# EAGLE design module (EAGLE 7.7.0)
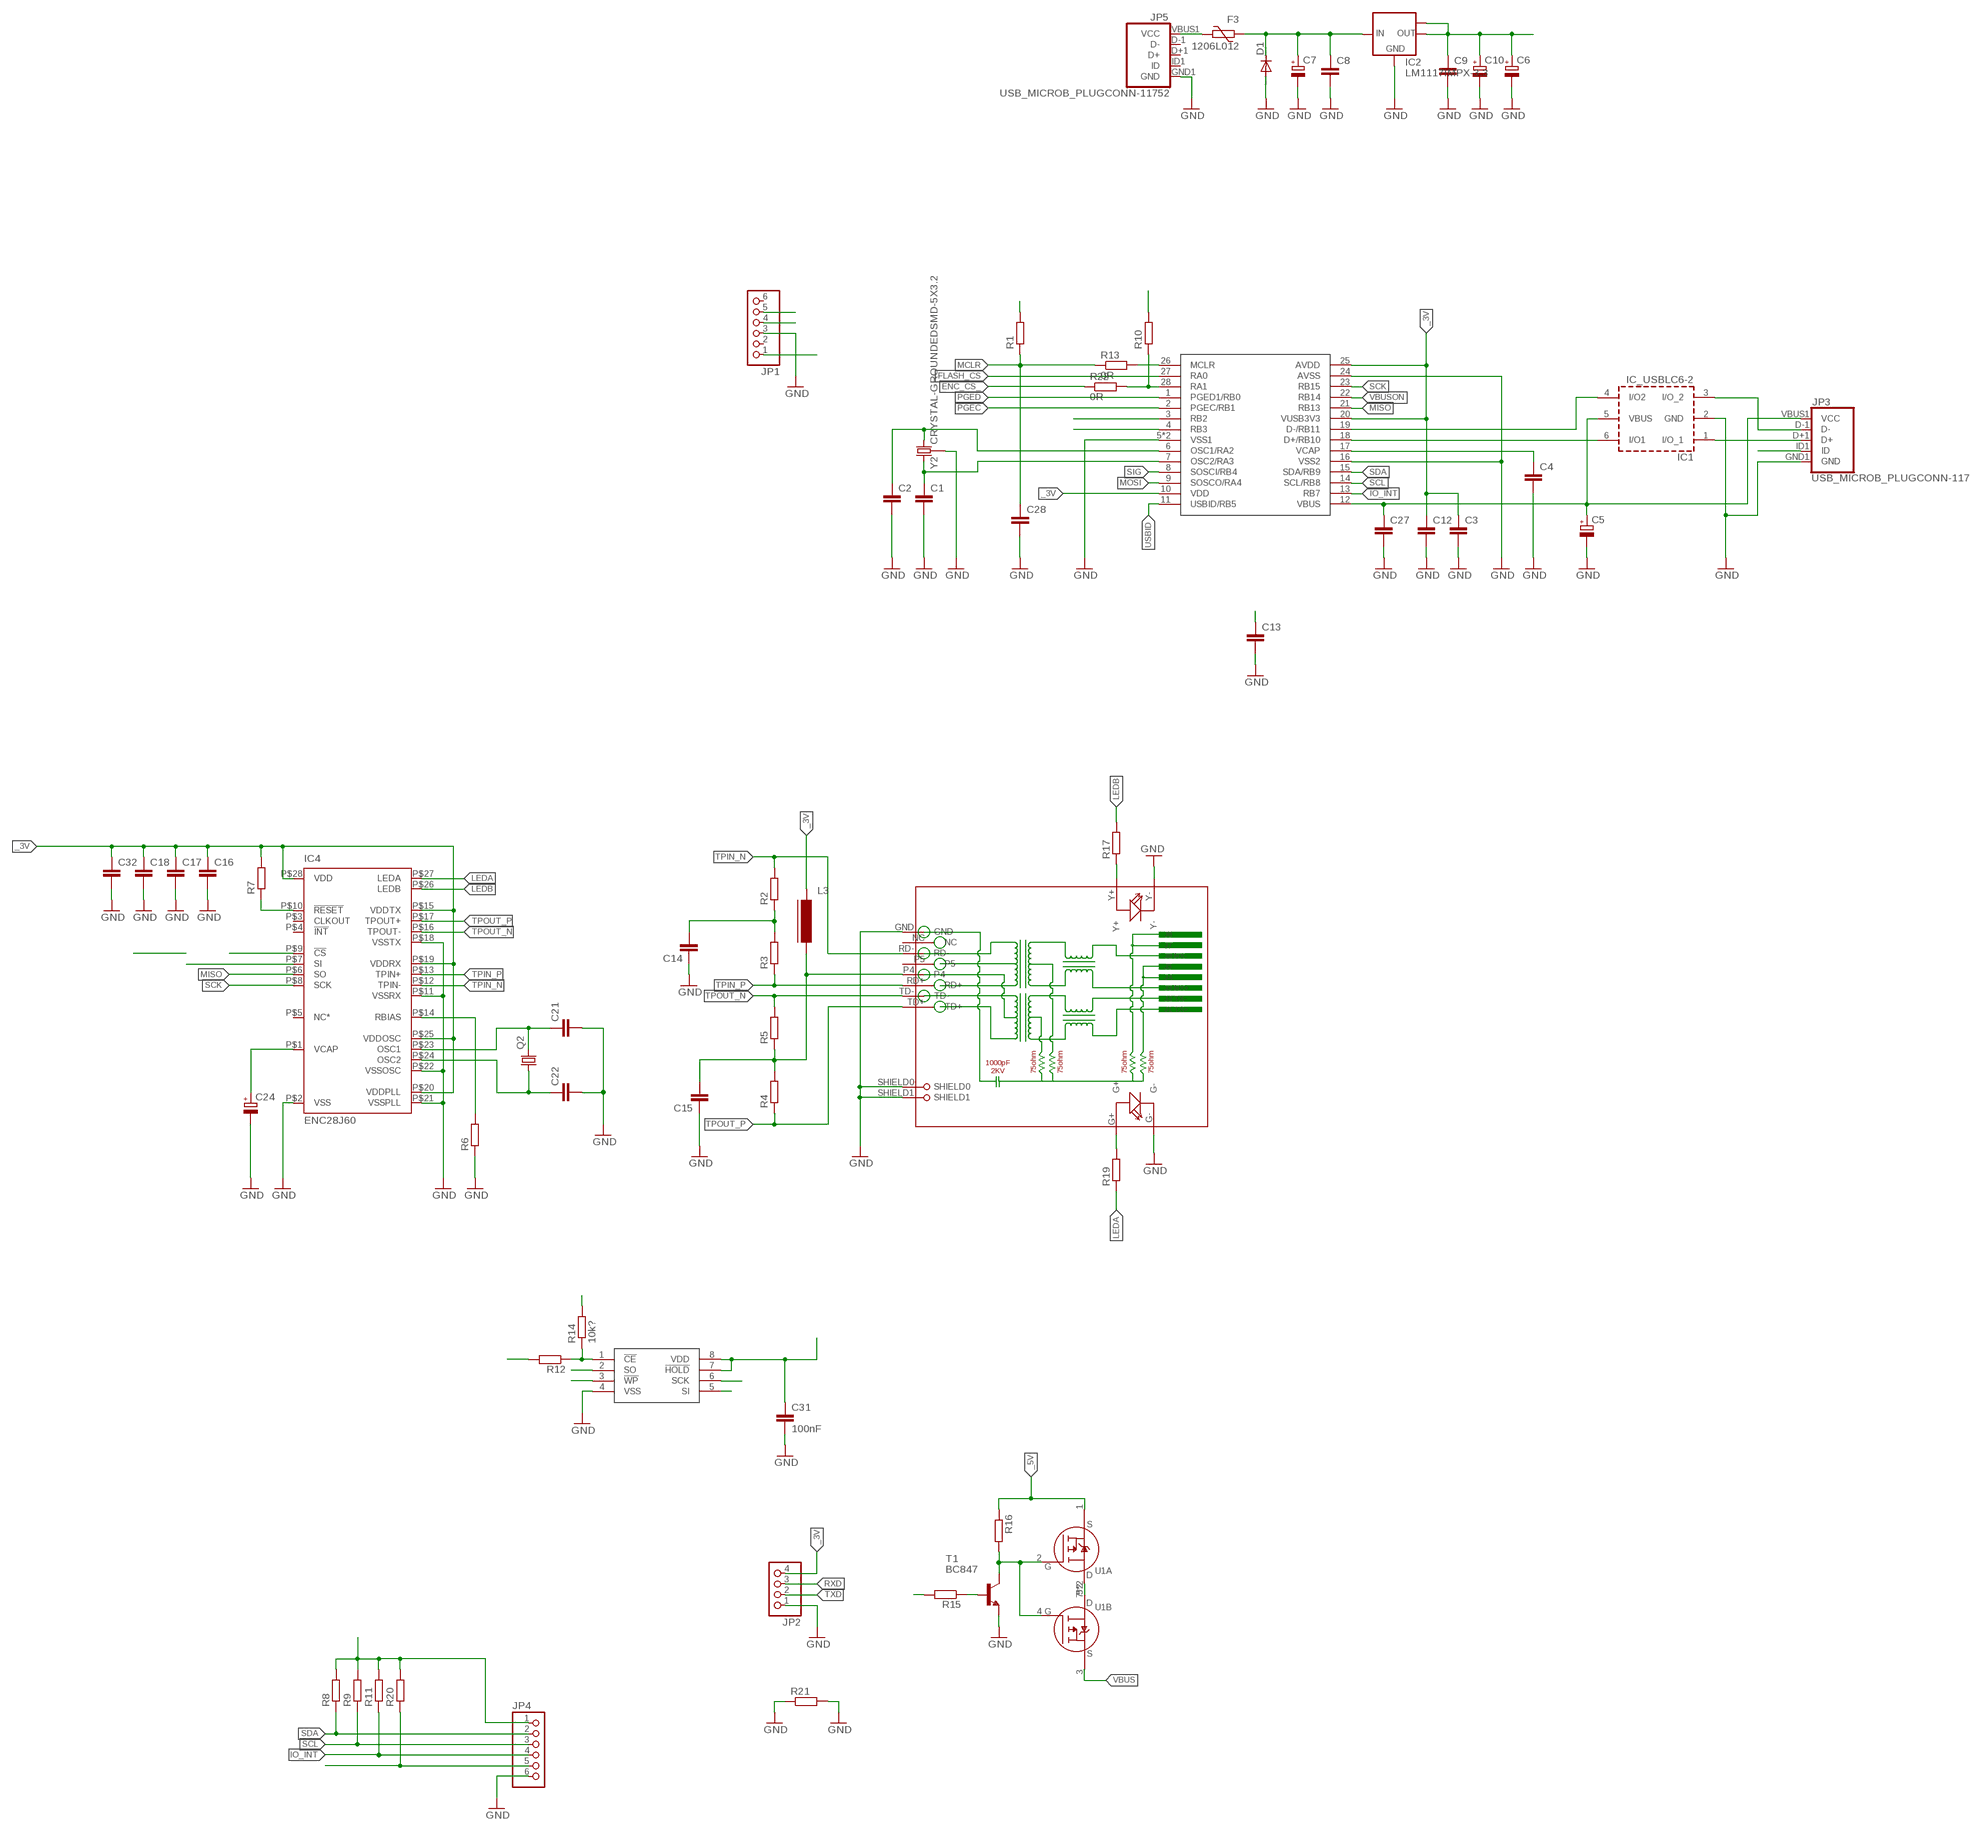
[diagram p0: schematic, sheet 1]

## Parts
C1  C-EUC0603  [C0603]
C2  C-EUC0603  [C0603]
C3  C-EUC0402  [C0402]
C4  C-EUC0603  [C0603]
C5  CPOL-EUSMCA  [SMC_A]
C6  CPOL-EUSMCA  [SMC_A]
C7  CPOL-EUSMCC  [SMC_C]
C8  C-EUC0603  [C0603]
C9  C-EUC0603  [C0603]
C10  CPOL-EUSMCB  [SMC_B]
C12  C-EUC0603  [C0603]
C13  C-EUC0603  [C0603]
C14  C-EUC0603  [C0603]
C15  C-EUC0603  [C0603]
C16  C-EUC0402  [C0402]
C17  C-EUC0402  [C0402]
C18  C-EUC0402  [C0402]
C21  C-EUC0603  [C0603]
C22  C-EUC0603  [C0603]
C24  CPOL-EUSMCA  [SMC_A]
C27  C-EUC0603  [C0603]
C28  C-EUC0603  [C0603]
C31  100nF  C-EUC0603  [C0603]
C32  C-EUC0402  [C0402]
D1  DIODE-SMB  [SMB]
F3  1206L012  [1206L]
IC1  IC_USBLC6-2  [SOT-23-6L]
IC2  LM1117IMPX-3.3  [SOT223]
IC4  ENC28J60  [TSSOP28W]
JP1  PINHD-1X6  [1X06]
JP2  PINHD-1X4  [1X04]
JP3  USB_MICROB_PLUGCONN-11752  [USB-B-MICRO-SMD_V03]
JP4  PINHD-1X6  [1X06]
JP5  USB_MICROB_PLUGCONN-11752  [USB-B-MICRO-SMD_V03]
L3  FERRITE-0805  [FB805]
Q2  CRYSTALHC49S  [HC49/S]
R1  R-EU_R0603  [R0603]
R2  R-EU_R0603  [R0603]
R3  R-EU_R0603  [R0603]
R4  R-EU_R0603  [R0603]
R5  R-EU_R0603  [R0603]
R6  R-EU_R0805  [R0805]
R7  R-EU_R0603  [R0603]
R8  R-EU_R0603  [R0603]
R9  R-EU_R0603  [R0603]
R10  R-EU_R0603  [R0603]
R11  R-EU_R0603  [R0603]
R12  R-EU_R0603  [R0603]
R13  0R  R-EU_R0603  [R0603]
R14  10k?  R-EU_R0603  [R0603]
R15  R-EU_R0603  [R0603]
R16  R-EU_R0402  [R0402]
R17  R-EU_R1206  [R1206]
R19  R-EU_R1206  [R1206]
R20  R-EU_R0603  [R0603]
R21  R-EU_R1206  [R1206]
R22  0R  R-EU_R0603  [R0603]
RJ1  HR911105A  [HR911105A]
T1  BC847  [SOT23]
U1  IRF7314_P_MOSFET  [SO-8]
U$1  PIC32MX250F128B  [QFN-S28-6X6]
U$2  SST25VF016BSO8M  [SO-08M]
Y2  CRYSTAL-GROUNDEDSMD-5X3.2  [CRYSTAL-SMD-5X3.2-4PAD]

## Nets
_3V: C3.1 C6.+ C9.1 C10.+ C12.1 C13.1 C16.1 C17.1 C18.1 C31.1 C32.1 IC2.2(OUT) IC2.TAB(OUT1) IC4.P$15(VDDTX) IC4.P$19(VDDRX) IC4.P$20(VDDPLL) IC4.P$25(VDDOSC) IC4.P$28(VDD) JP2.4 JP4.1 L3.1 R1.2 R7.2 R8.2 R9.2 R10.2 R11.2 R14.2 R20.2 U$1.10(VDD) U$1.20(VUSB3V3) U$1.25(AVDD) U$2.3(!WP) U$2.7(!HOLD) U$2.8(VDD)
_5V: C7.+ C8.1 D1.C F3.2 IC2.3(IN) R16.1 U1.1(A:S)
D_N: IC1.4(I/O2) U$1.19(D-/RB11)
D_P: IC1.6(I/O1) U$1.18(D+/RB10)
ENC_CS_: IC4.P$9(!CS) R22.1
ENC_RST: IC4.P$10(!RESET) R7.1
FLASH_CS: R12.2 U$1.27(RA0)
GND: C1.2 C2.2 C3.2 C4.2 C5.- C6.- C7.- C8.2 C9.2 C10.- C12.2 C13.2 C14.1 C15.1 C16.2 C17.2 C18.2 C21.2 C22.2 C24.- C27.2 C28.2 C31.2 C32.2 D1.A IC1.2(GND) IC2.1(GND) IC4.P$2(VSS) IC4.P$11(VSSRX) IC4.P$18(VSSTX) IC4.P$21(VSSPLL) IC4.P$22(VSSOSC) JP1.3 JP2.1 JP3.GND1(GND) JP4.6 JP5.GND1(GND) R6.1 R21.1 R21.2 RJ1.G- RJ1.GND RJ1.SHIELD0 RJ1.SHIELD1 RJ1.Y- T1.2(E) U$1.5(VSS1) U$1.16(VSS2) U$1.24(AVSS) U$1.EXP(VSS1) U$2.4(VSS) Y2.2 Y2.4
IO_INT: JP4.4 R11.1 U$1.13(RB7)
LEDA: IC4.P$27(LEDA) R19.1
LEDB: IC4.P$26(LEDB) R17.2
MCLR: C28.1 JP1.1 R1.1 R13.1
MCLR_: R13.2 U$1.26(MCLR)
MISO: IC4.P$6(SO) U$1.21(RB13) U$2.2(SO)
MOSI: IC4.P$7(SI) U$1.9(SOSCO/RA4) U$2.5(SI)
N$1: R15.1 T1.1(B)
N$2: C14.2 R2.1 R3.2
N$4: C1.1 U$1.7(OSC2/RA3) Y2.3
N$5: C2.1 U$1.6(OSC1/RA2) Y2.1
N$6: C15.2 L3.2 R4.2 R5.1 RJ1.P4
N$7: C4.1 U$1.17(VCAP)
N$8: F3.1 JP5.VBUS1(VCC)
N$9: IC1.1(I/O_1) JP3.D+1(D+)
N$10: IC1.3(I/O_2) JP3.D-1(D-)
N$11: R12.1 R14.1 U$2.1(!CE)
N$12: IC4.P$14(RBIAS) R6.2
N$13: R16.2 T1.3(C) U1.2(A:G) U1.4(B:G)
N$19: R10.1 R22.2 U$1.28(RA1)
N$20: U1.5(B:D) U1.6(B:D) U1.7(A:D) U1.8(A:D)
N$22: C21.1 IC4.P$23(OSC1) Q2.2
N$23: C22.1 IC4.P$24(OSC2) Q2.1
N$29: C24.+ IC4.P$1(VCAP)
N$30: R17.1 RJ1.Y+
N$31: R19.2 RJ1.G+
PGEC: JP1.5 U$1.2(PGEC/RB1)
PGED: JP1.4 U$1.1(PGED1/RB0)
RXD: JP2.3 U$1.3(RB2)
SCK: IC4.P$8(SCK) U$1.23(RB15) U$2.6(SCK)
SCL: JP4.3 R9.1 U$1.14(SCL/RB8)
SDA: JP4.2 R8.1 U$1.15(SDA/RB9)
SIG: JP4.5 R20.1 U$1.8(SOSCI/RB4)
TPIN_N: IC4.P$12(TPIN-) R2.2 RJ1.RD-
TPIN_P: IC4.P$13(TPIN+) R3.1 RJ1.RD+
TPOUT_N: IC4.P$16(TPOUT-) R5.2 RJ1.TD-
TPOUT_P: IC4.P$17(TPOUT+) R4.1 RJ1.TD+
TXD: JP2.2 U$1.4(RB3)
USBID: JP3.ID1(ID) U$1.11(USBID/RB5)
VBUS: C5.+ C27.1 IC1.5(VBUS) JP3.VBUS1(VCC) U1.3(B:S) U$1.12(VBUS)
VBUSON: R15.2 U$1.22(RB14)
Unconnected: IC4.P$3(CLKOUT) IC4.P$4(!INT) IC4.P$5(NC*) JP1.2 JP1.6 JP5.D+1(D+) JP5.D-1(D-) JP5.ID1(ID) RJ1.NC RJ1.P5

## Library data of the parts
C1-C4 C8 C9 C12-C18 C21 C22 C27 C28 C31 C32 = rcl:C-EU: CAPACITOR, European symbol
C5-C7 C10 C24 = rcl:CPOL-EU: POLARIZED CAPACITOR, European symbol
D1 = diode:DIODE-: DIODE
F3 = polyfuse-smd_10:?: Polyfuse Resettable PTC Source: http://www.littelfuse.com/products/resettable-ptcs.aspx; MF: Littelfuse; MPN: 1206L012; OC_FARNELL: 1596988; OC_NEWARK: 05M2298
IC1 = dp_devices:IC_USBLC6-2
IC2 = lm1117:LM1117IMPX-*
IC4 = microchip:ENC28J60: Stand-Alone Ethernet Controller with SPI Interface Source: http://ww1.microchip.com/downloads/en/DeviceDoc/39662c.pdf
JP1 JP4 = pinhead:PINHD-1X6: PIN HEADER
JP2 = pinhead:PINHD-1X4: PIN HEADER
JP3 JP5 = SparkFun-Connectors:USB_MICROB_PLUG: USB Micro-B connectors Some male, some female. Watch your step!; PROD_ID: CONN-11752
L3 = dp_devices:FERRITE: Ferrite bead in various packages
Q2 = crystal:CRYSTAL: CRYSTAL; OC_FARNELL: 1667008; OC_NEWARK: unknown
R1-R17 R19-R22 = rcl:R-EU_: RESISTOR, European symbol
RJ1 = hanrun:HR911105A
T1 = transistor:BC847: NPN TRANSISTOR
U1 = ihpcb-mosfet:IRF7314_P_MOSFET: P-channel MOSFET IRF7314 SO-8 package
U$1 = microchip-pic32mx_mod:PIC32MX250F128B
U$2 = mw:SST25VF016B
Y2 = SparkFun-Clocks:CRYSTAL-GROUNDED: Crystals w/ Ground Pin (Generic) These are passive quartz crystals, which can be used as a clock source for a microcontroller. Crystal's are usually two-terminal devices. A third terminal may be optionally connected to ground, as recommended by the manufaturer.

## Board
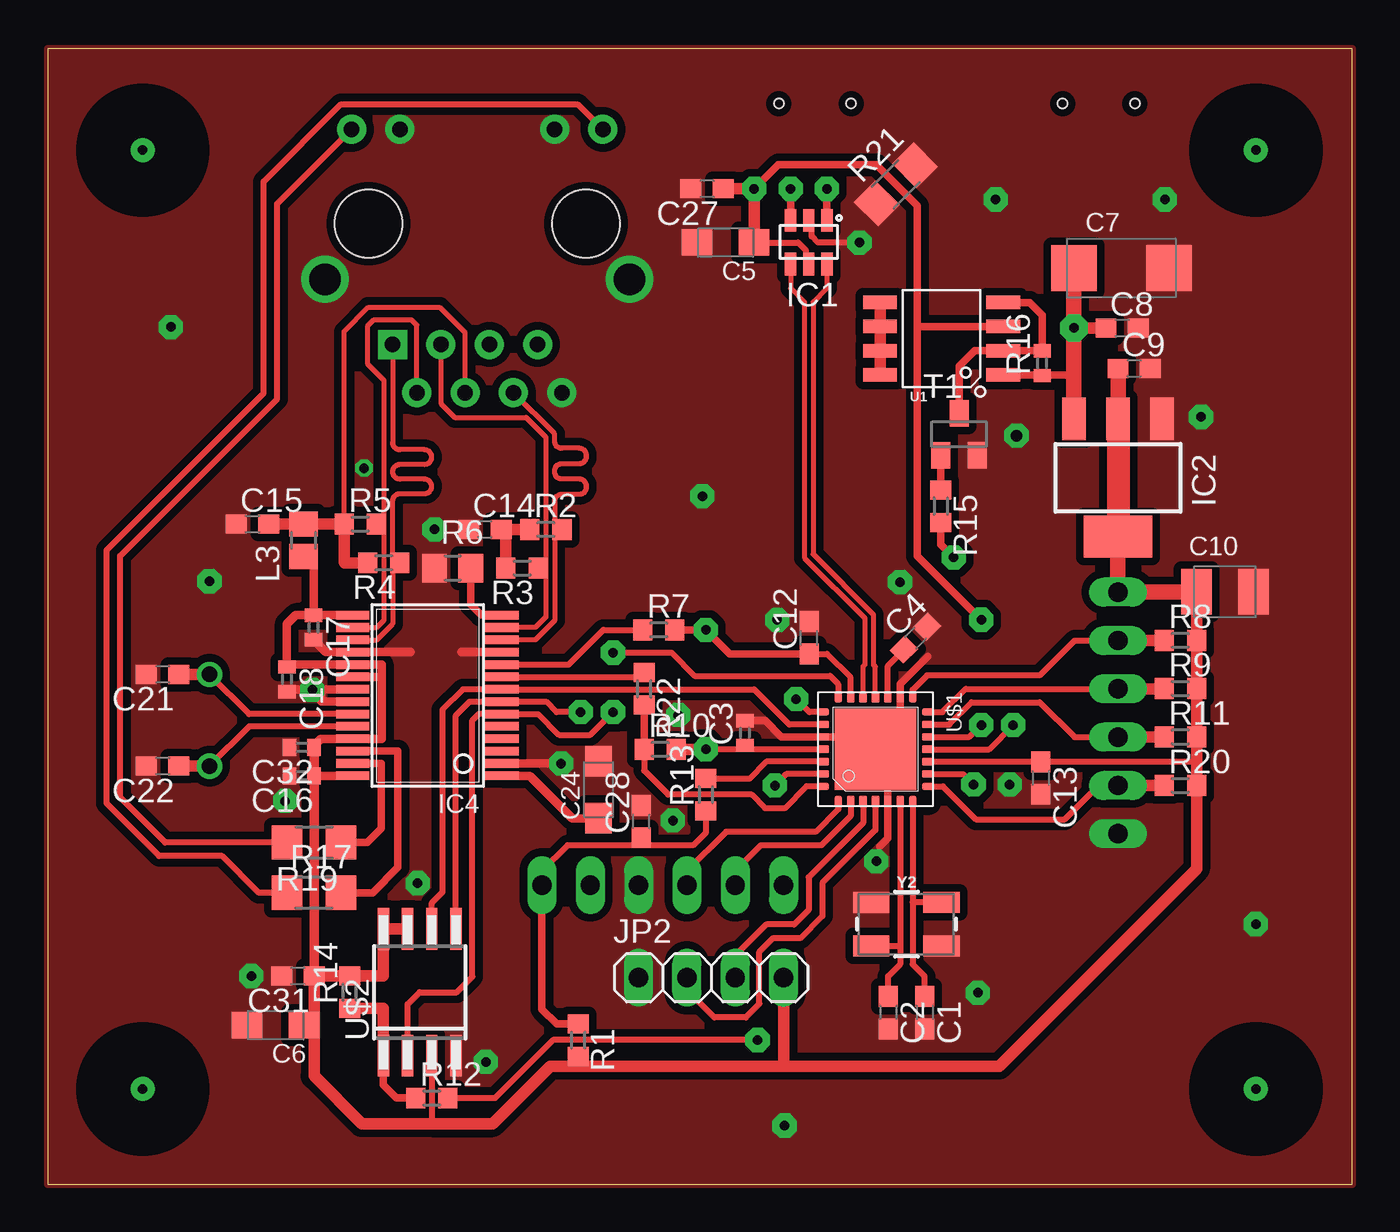
[diagram p1: board, top side]
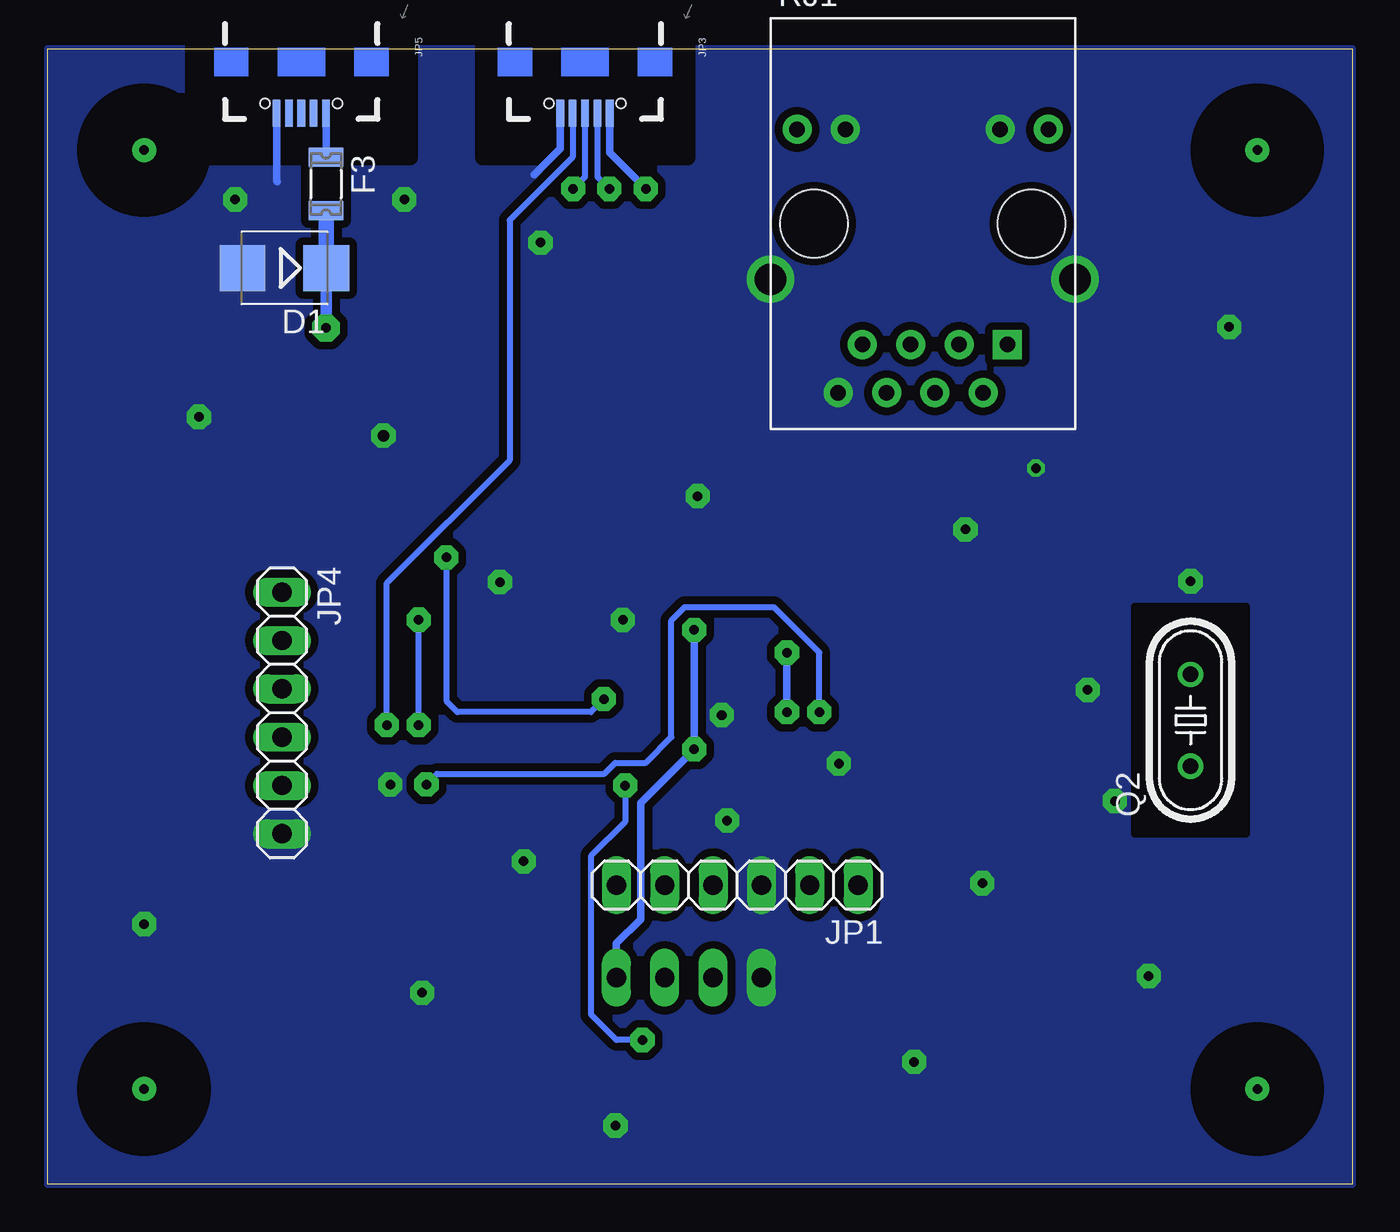
[diagram p2: board, bottom side, seen from below]

Size 68.58 x 59.69 mm. Coordinates in mm from the lower left corner, seen from the top.
Outline: 0,0 68.58,0 68.58,59.69 0,59.69 0,0
Copper layers (1*16): Top 0.035mm / dielectric 1.5mm / Bottom 0.035mm
Design rules "default *": minimum track width 10mil, minimum drill 24mil, track to track 8mil, track to pad 8mil, pad to pad 8mil, via to via 8mil, smd to smd 8mil, copper to edge 0mil, drill to drill 8mil, minimum pad ring 10mil, minimum via ring 8mil, stop-mask expansion 4mil, vias tented up to drill 0mil, thermal gap 10mil
tRestrict: area 39.7,50.2 to 40.3,51.2; area 15.1,21.2 to 16.9,30.1; area 23,21.2 to 24.8,30.1; area 40.7,20 to 46.4,25.7; area 2.2,51.6 to 7.8,57.2; area 60.7,51.6 to 66.3,57.2; area 2.2,2.2 to 7.8,7.8; area 60.7,2.2 to 66.3,7.8
bRestrict: area 34.9,54 to 45.7,59.7; area 49.5,54 to 61,59.7; area 2.2,51.6 to 7.8,57.2; area 60.7,51.6 to 66.3,57.2; area 2.2,2.2 to 7.8,7.8; area 60.7,2.2 to 66.3,7.8

### Footprints (pad centres in the part's own frame; a part is rotated, then mirrored left to right if it is on the bottom)
C0603 = smd 1.1 x 1: 1 -0.85,0; 2 0.85,0
C0402 = smd 0.7 x 0.9: 1 -0.65,0; 2 0.65,0
SMC_A = smd 1.6 x 1.4: + -1.5,0; - 1.5,0
SMC_C = smd 2.4 x 2.4: + -2.5,0; - 2.5,0
SMC_B = smd 1.6 x 2.4: + -1.5,0; - 1.5,0
SMB = smd 2.4 x 2.4: A 2.2,0; C -2.2,0
1206L = smd 1 x 1.8: 1 -1.4,0; 2 1.4,0
SOT-23-6L = smd 0.6 x 1.2: 1 -0.95,-2.3; 2 0,-2.3; 3 0.95,-2.3; 4 0.95,0; 5 0,0; 6 -0.95,0
SOT223 = smd 1.219 x 2.235: 1 -2.311,-3.099; 2 0,-3.099; 3 2.311,-3.099 | smd 3.6 x 2.2: TAB 0,3.099
TSSOP28W = smd 0.45 x 1.75: P$1 0,-0.65; P$2 0.65,-0.65; P$3 1.3,-0.65; P$4 1.95,-0.65; P$5 2.6,-0.65; P$6 3.25,-0.65; P$7 3.9,-0.65; P$8 4.55,-0.65; P$9 5.2,-0.65; P$10 5.85,-0.65; P$11 6.5,-0.65; P$12 7.15,-0.65; P$13 7.8,-0.65; P$14 8.45,-0.65; P$15 8.45,7.2; P$16 7.8,7.2; P$17 7.15,7.2; P$18 6.5,7.2; P$19 5.85,7.2; P$20 5.2,7.2; P$21 4.55,7.2; P$22 3.9,7.2; P$23 3.25,7.2; P$24 2.6,7.2; P$25 1.95,7.2; P$26 1.3,7.2; P$27 0.65,7.2; P$28 0,7.2
1X06 = drill 1.016 long: 1 -6.35,0; 2 -3.81,0; 3 -1.27,0; 4 1.27,0; 5 3.81,0; 6 6.35,0
1X04 = drill 1.016 long: 1 -3.81,0; 2 -1.27,0; 3 1.27,0; 4 3.81,0
USB-B-MICRO-SMD_V03 = smd 1.4 x 0.4: D+1 2.7,0; D-1 2.7,0.65; GND1 2.7,-1.3; ID1 2.7,-0.65; VBUS1 2.7,1.3 | hole 0.5: 2.2,1.9; 2.2,-1.9
FB805 = smd 1.3 x 1.5: 1 -0.85,0; 2 0.85,0
HC49/S = drill 0.813: 1 -2.413,0; 2 2.413,0
R0603 = smd 1 x 1.1: 1 -0.85,0; 2 0.85,0
R0805 = smd 1.3 x 1.5: 1 -0.95,0; 2 0.95,0
R0402 = smd 0.7 x 0.9: 1 -0.65,0; 2 0.65,0
R1206 = smd 1.6 x 1.803: 1 -1.422,0; 2 1.422,0
HR911105A = drill 0.813 pad 1.524: G+ 4.953,-6.604; G- 4.953,-4.064; GND -8.89,4.445; NC -6.35,3.175; P4 -8.89,-0.635; P5 -6.35,0.635; RD+ -6.35,-1.905; RD- -8.89,1.905; TD- -8.89,-3.175; Y+ 4.953,6.604; Y- 4.953,4.064 | drill 1.651 pad 2.159: SHIELD0 -2.921,8.001; SHIELD1 -2.921,-8.001 | drill 0.813 pad 1.524 square: TD+ -6.35,-4.445 | hole 3.556: 0,-5.715; 0,5.715
SOT23 = smd 1 x 1.4: 1 -0.95,-1.1; 2 0.95,-1.1; 3 0,1.1
SO-8 = smd 0.711 x 1.778: 1 -1.905,-3.239; 2 -0.635,-3.239; 3 0.635,-3.239; 4 1.905,-3.239; 5 1.905,3.239; 6 0.635,3.239; 7 -0.635,3.239; 8 -1.905,3.239
QFN-S28-6X6 = smd 0.6 x 0.4: 1 2.75,-1.95; 2 2.75,-1.3; 3 2.75,-0.65; 4 2.75,0; 5 2.75,0.65; 6 2.75,1.3; 7 2.75,1.95; 15 -2.75,1.95; 16 -2.75,1.3; 17 -2.75,0.65; 18 -2.75,0; 19 -2.75,-0.65; 20 -2.75,-1.3; 21 -2.75,-1.95 | smd 0.4 x 0.6: 8 1.95,2.75; 9 1.3,2.75; 10 0.65,2.75; 11 0,2.75; 12 -0.65,2.75; 13 -1.3,2.75; 14 -1.95,2.75; 22 -1.95,-2.75; 23 -1.3,-2.75; 24 -0.65,-2.75; 25 0,-2.75; 26 0.65,-2.75; 27 1.3,-2.75; 28 1.95,-2.75 | smd 4.3 x 4.3: EXP 0,0
SO-08M = smd 0.6 x 2.2: 1 -1.905,-3.33; 2 -0.635,-3.33; 3 0.635,-3.33; 4 1.905,-3.33; 5 1.905,3.33; 6 0.635,3.33; 7 -0.635,3.33; 8 -1.905,3.33
CRYSTAL-SMD-5X3.2-4PAD = smd 1.9 x 1.1: 1 -1.85,-1.15; 2 1.85,-1.15; 3 1.85,1.15; 4 -1.85,1.15

### Placement (x,y rotation side)
C1  46.1,9.02 270 top
C2  44.18,9.02 270 top
C3  36.65,23.71 90 top
C4  45.61,28.7 45 top
C5  35.64,49.5 180 top
C6  11.99,8.36 180 top
C7  56.44,48.16 0 top
C8  56.48,45.01 0 top
C9  57.11,42.88 0 top
C10  61.88,31.14 0 top
C12  40.02,28.72 90 top
C13  52.2,21.35 270 top
C14  22.99,34.42 0 top
C15  10.77,34.7 0 top
C16  13.36,21.46 180 top
C17  13.98,29.26 270 top
C18  12.58,26.54 270 top
C21  6.05,26.8 180 top
C22  6.05,21.97 180 top
C24  28.96,20.73 90 top
C27  34.66,52.32 180 top
C28  31.21,19.06 90 top
C31  13.16,10.93 180 top
C32  13.36,22.96 180 top
D1  56.13,48.16 180 bottom
F3  53.95,52.58 270 bottom
IC1  40.01,48.36 180 top
IC2  56.26,37.13 180 top
IC4  23.24,21.46 90 top
JP1  32.33,15.72 180 bottom
JP2  34.87,10.85 0 top
JP3  40.34,59 270 bottom
JP4  56.26,24.77 270 bottom
JP5  55.24,59 270 bottom
L3  13.46,33.85 90 top
Q2  8.51,24.38 90 bottom
R1  27.89,7.57 270 top
R2  26.19,34.42 0 top
R3  24.94,32.38 180 top
R4  17.67,32.66 180 top
R5  16.43,34.7 0 top
R6  21.29,32.38 0 top
R7  32.12,29.13 0 top
R8  59.54,28.59 0 top
R9  59.54,26.05 0 top
R10  32.2,22.86 0 top
R11  59.54,23.51 0 top
R12  20.19,4.52 0 top
R13  34.59,20.47 90 top
R14  15.88,10.08 90 top
R15  46.95,35.64 270 top
R16  52.27,43.15 90 top
R17  14.01,15.32 0 top
R19  14.01,17.96 180 top
R20  59.54,20.95 0 top
R21  44.59,52.57 45 top
R22  31.35,26.04 270 top
RJ1  22.58,50.5 90 bottom
T1  47.9,39.42 0 top
U1  46.99,44.45 90 top
U$1  43.51,22.86 270 top
U$2  19.56,10.08 0 top
Y2  45.14,13.67 0 top

### Tracks (layer width: path | path; a pad name or v marks a point on that pad's centre or on a via)
_3V  (via drill 0.5 pad 1.27)
  Top 0.305: U$1.20 42.21,26.62 40.96,27.87 C12.1 40.02,27.73 | U$1.25 36.83,22.86 | 36.83,22.86 v34.59,22.86 | C3.1 36.65,23.04 36.83,22.86 | U$2.3 20.19,3.17 | U$1.10 52.07,22.21 | 52.07,22.21 60.39,22.21 | C13.1 52.08,22.2 52.07,22.21 | R1.2 27.89,6.4 27.94,6.2
  Top 0.406: C6.+ 13.91,8.36 14.01,8.26 | C12.1 35.86,27.87 v34.59,29.13 R7.2
  Top 0.457: IC4.P$20 17.55,26.66 | 17.55,26.66 17.55,23.41 IC4.P$25 14.37,23.41 14.01,23.05 C32.1 | IC4.P$28 C16.1 | 17.55,26.66 17.55,27.31 IC4.P$19 12.58,27.31 C18.1 12.58,29.45 13.04,29.91 C17.1 | IC4.P$15 C17.1 | C17.1 13.98,32.52 13.93,32.52 L3.1
  Top 0.508: C32.1 C16.1 C31.1
  Top 0.61: U$2.7 U$2.8 17.65,10.93 R14.2 C31.1 14.01,8.26 14.01,5.68 16.51,3.17 20.19,3.17 23.39,3.17 26.42,6.2 27.94,6.2 38.68,6.2 | 38.68,6.2 50.01,6.2 60.39,16.57 R20.2 60.39,22.21 R11.2 R9.2 R8.2 60.39,31.13 C10.+ | 56.24,34.01 56.25,34.02 | JP2.4 38.68,6.2 | R10.2 v34.59,22.86
  Top 0.813: IC2.2 C9.1 | 56.25,34.02 56.25,31.13 JP4.1 60.35,31.11 C10.+
  Top 1.016: 56.25,34.02 IC2.TAB
  Top 1.219: IC2.2 IC2.TAB
  Bottom 0.406: v34.59,29.13 v34.59,22.86 37.41,20.04 37.41,13.92 38.68,12.65 JP2.4
_5V  (via drill 0.5 pad 1.42)
  Top 0.406: U1.1 52.32,42.55 | 52.32,42.55 53.95,42.55 | R16.1 52.28,42.51 52.32,42.55
  Top 0.61: C7.+ | IC2.3 | C8.1 v53.95,45.01
  Top 0.813: C7.+ v53.95,45.01 53.95,42.55 IC2.3
  Bottom 0.61: C7.+ v53.95,45.01
  Bottom 0.813: F3.2 C7.+ D1.C
D_N
  Top 0.254: IC1.4 39.05,47.09 39.78,46.37 39.78,32.92 42.95,29.75 42.95,27.3 42.86,27.21 U$1.19
D_P
  Top 0.254: IC1.6 40.95,47.09 40.23,46.37 40.23,33.12 43.41,29.94 43.41,27.3 43.51,27.2 U$1.18
ENC_CS_
  Top 0.305: IC4.P$9 31.13,26.66 R22.1
ENC_RST
  Top 0.305: IC4.P$10 27.39,27.31 29.21,29.13 R7.1
FLASH_CS  (via drill 0.5 pad 1.27)
  Top 0.305: U$1.27 38.83,21.56 v38.23,20.95 | R12.2 23.52,4.52 26.57,7.57 v37.31,7.57
  Bottom 0.305: v38.23,20.95 38.23,19.05 40.01,17.27 40.01,8.89 38.68,7.57 v37.31,7.57
GND  (via drill 0.5, 0.5 pad 1.27, 0.6 pad 1.27)
  Top 0.305: v42.67,49.51 40.48,49.51 40.15,49.84 40.15,50.57 40.09,50.57 IC1.2
  Top 0.401: C3.2 37.72,24.36 38.57,23.51 U$1.24 42.86,23.51 U$1.EXP | U$1.EXP 44.81,24.16 U$1.16 44.81,26.29 46.25,27.74 | U$1.EXP 44.16,22.21 U$1.5 44.16,18.18 43.74,17.75
  Top 0.457: IC4.P$11 21.75,27.96 | 19.08,27.96 IC4.P$18 14.61,27.96 13.98,28.59 C17.2 | IC4.P$2 v26.99,22.11 | IC4.P$21 14.38,26.01 | 14.38,26.01 12.58,26.01 C18.2 | IC4.P$22 14.38,25.36 14.38,26.01
  Bottom 0.406: JP3.GND1 41.63,54.43 43,53.06 | JP5.GND1 56.55,52.73 56.52,52.7
  other vias: 38.35,29.66 44.81,31.65 16.64,37.64 19.45,15.82 13.91,25.98 12.49,20.14 43.56,16.97 48.9,10.06 8.51,31.69 20.34,34.42 23.03,6.42 10.71,10.93 60.62,40.34 50.56,21 33.15,24.66 63.51,13.67 58.72,51.77 6.48,45.06 38.73,3.07 34.42,36.17 50.93,39.34 49.83,51.77 32.86,19.12
  pour Top (isolate 0.406, rank 2, no thermals): 0,59.69 0,0 68.58,0 68.58,59.69
  pour Bottom (isolate 0.406, no thermals): 0,59.69 0,0 68.58,0 68.58,59.69
IO_INT
  Top 0.305: U$1.13 47.4,24.16 48.56,25.32 52.15,25.32 53.98,23.5 JP4.4
  Top 0.61: JP4.4 58.68,23.5 R11.1
LEDA
  Top 0.406: IC4.P$27 17.53,22.11 17.53,18.69 16.79,17.96 R19.1
LEDB
  Top 0.406: IC4.P$26 18.41,22.76 18.41,16.64 17.09,15.32 R17.2
MCLR
  Top 0.305: 31.5,17.8 33.93,17.8 34.59,18.47 R13.1 | 31.5,17.8 27.33,17.8 25.98,16.46 JP1.1 | C28.1 31.21,18.09 31.5,17.8
  Top 0.406: R1.1 26.76,8.42 25.98,9.2 JP1.1
MCLR_
  Top 0.305: U$1.26 37.78,22.21 36.89,21.32 R13.2
MISO  (via drill 0.5 pad 1.27)
  Top 0.305: U$2.2 18.92,9.45 19.56,10.08 21.51,10.08 22.33,10.9 22.33,24.38 22.66,24.71 IC4.P$6 25.78,24.71 26.87,23.62 28.53,23.62 v29.72,24.81 | v29.72,27.94 32.79,27.94 34.01,26.72 41.12,26.72 41.55,26.29 U$1.21
  Bottom 0.406: v29.72,27.94 v29.72,24.81
MOSI  (via drill 0.5 pad 1.27)
  Top 0.305: U$2.5 21.46,24.64 22.19,25.36 IC4.P$7 26.2,25.36 26.75,24.81 v28.02,24.81 | U$1.9 48.11,21.56 v48.67,21
  Bottom 0.305: v48.67,21 48.1,21.57 39.32,21.57 38.73,22.15 37.13,22.15 35.79,23.5 35.79,29.64 35.1,30.33 30.4,30.33 28.02,27.94 v28.02,24.81
N$1
  Top 0.406: R15.1 T1.1
N$2
  Top 0.61: R3.2 24.09,34.24 24.02,34.24 C14.2 R2.1
N$3
  cutout Bottom: 52.64,53.34 52.64,51.44 55.25,51.44 55.25,53.34
N$4
  Top 0.305: U$1.7 45.46,14.81 | 45.46,14.81 45.46,11.56 46.09,10.93 C1.1 | Y2.3 45.46,14.81
N$5
  Top 0.305: U$1.6 44.81,12.52 | 44.81,12.52 44.81,11.56 44.17,10.93 C2.1 | Y2.1 44.81,12.52
N$6
  Top 0.254: RJ1.P4 21.95,44.76 20.6,46.1 16.87,46.1 15.58,44.82 R5.1
  Top 0.61: R4.2 15.62,32.66 15.58,32.7 R5.1 L3.2 C15.2
N$7
  Top 0.305: U$1.17 44.16,27.25 C4.1
N$8
  Bottom 0.406: JP5.VBUS1 F3.1
N$9  (via drill 0.5 pad 1.27)
  Top 0.406: IC1.1 v40.95,52.32
  Bottom 0.305: JP3.D+1 40.34,52.94 v40.95,52.32
N$10  (via drill 0.5 pad 1.27)
  Top 0.406: IC1.3 v39.05,52.32
  Bottom 0.305: JP3.D-1 39.69,52.95 v39.05,52.32
N$11
  Top 0.406: R12.1 18.34,4.52 17.65,5.21 U$2.1
  Top 0.61: R14.1 17.65,9.23 U$2.1
N$12
  Top 0.406: IC4.P$14 22.79,29.91 22.23,30.47 R6.2
N$13
  Top 0.406: T1.3 47.9,43 48.72,43.81 U1.2 52.26,43.81 R16.2 52.27,45.7 51.61,46.35 U1.4
N$14
  cutout Bottom: 5.59,30.35 5.59,18.41 11.43,18.41 11.43,30.35
N$15  (via drill 0.5 pad 1.27)
  other vias: 5,54.36
N$16  (via drill 0.5 pad 1.27)
  other vias: 5,5
N$17  (via drill 0.5 pad 1.27)
  other vias: 63.51,5
N$18  (via drill 0.5 pad 1.27)
  other vias: 63.51,54.36
N$19
  Top 0.305: U$1.28 39.88,20.91 38.73,19.76 37.72,19.76 37.01,20.47 32.61,20.47 31.35,21.73 R10.1
  Top 0.406: R22.2 R10.1
N$20
  Top 0.61: U1.5 U1.6 U1.7 U1.8
N$22
  Top 0.305: IC4.P$23 10.59,24.71 Q2.2
  Top 0.61: C21.1 Q2.2
N$23
  Top 0.305: IC4.P$24 10.6,24.06 Q2.1
  Top 0.61: C22.1 Q2.1
N$29
  Top 0.457: IC4.P$1 25.35,21.46 27.59,19.23 C24.+
N$30
  Top 0.305: R17.1 11.1,15.32 9.17,17.25 5.87,17.25 3.1,20.02 3.1,33.33 11.35,41.58 11.35,52.7 15.42,56.77 27.86,56.77 RJ1.Y+
N$31
  Top 0.305: R19.2 6.17,17.96 3.81,20.32 3.81,33.02 12.06,41.27 12.06,51.54 RJ1.G+
PGEC
  Top 0.305: U$1.2 42.21,19.35 40.66,17.8 37.49,17.8 36.14,16.46 JP1.5
PGED
  Top 0.305: U$1.1 41.56,19.72 40.36,18.52 35.66,18.52 33.6,16.46 JP1.4
RXD
  Top 0.305: U$1.3 42.86,18.98 40.01,16.13 40.01,14.4 39.24,13.64 37.77,13.64 36.2,12.06 36.2,10.9 JP2.3
SCK
  Top 0.305: U$2.6 20.19,14.78 20.75,15.34 20.75,24.94 21.82,26.01 IC4.P$8 37.13,26.01 38.98,24.16 U$1.23
SCL
  Top 0.305: U$1.14 47.03,24.81 48.26,26.04 JP4.3
  Top 0.61: JP4.3 58.68,26.04 R9.1
SDA
  Top 0.305: U$1.15 45.46,25.98 46.23,26.75 52.15,26.75 53.98,28.57 JP4.2
  Top 0.61: JP4.2 58.68,28.57 R8.1
SIG
  Top 0.305: U$1.8 47.06,20.91 48.79,19.18 53.47,19.18 55.24,20.95 JP4.5
  Top 0.61: JP4.5 R20.1
TPIN_N
  Top 0.254: IC4.P$12 25.63,28.61 26.64,29.62 26.64,34.44 | RJ1.RD- 26.64,39.45 26.64,39.06 arc90 27.03,38.68 27.94,38.68 arc-90 28.32,38.3 28.32,38.26 arc-90 27.94,37.88 27.03,37.88 arc90 26.64,37.5 26.64,37.45 arc90 27.03,37.07 27.94,37.07 arc-90 28.32,36.69 28.32,36.65 arc-90 27.94,36.26 27.03,36.26 arc90 26.64,35.88 26.64,34.44 | R2.2 26.67,34.42 26.64,34.44
TPIN_P
  Top 0.254: IC4.P$13 25.64,29.26 26.19,29.81 26.19,32.69 | 26.19,32.69 26.19,39.27 25.15,40.31 21.41,40.31 20.68,41.05 RJ1.RD+ | R3.1 25.88,32.38 26.19,32.69
TPOUT_N
  Top 0.254: R5.2 17.68,34.7 | 17.68,34.7 17.68,42.27 16.84,43.1 16.84,45.14 17.14,45.44 19.13,45.44 19.41,45.16 RJ1.TD- | 17.68,34.7 17.68,29.64 17.31,29.26 IC4.P$16
TPOUT_P
  Top 0.254: 18.14,32.66 18.14,29.45 17.3,28.61 IC4.P$17 | R4.1 18.14,32.66 | 18.14,32.66 18.14,35.91 arc-90 18.52,36.29 19.8,36.29 arc90 20.18,36.67 20.18,36.68 arc90 19.8,37.06 18.52,37.06 arc-90 18.14,37.45 18.14,37.46 arc-90 18.52,37.84 19.8,37.84 arc90 20.18,38.22 20.18,38.23 arc90 19.8,38.61 18.52,38.61 arc-90 18.14,38.99 RJ1.TD+
TXD
  Top 0.305: U$1.4 43.51,18.62 40.72,15.82 40.72,14.1 39.55,12.93 38.12,12.93 37.41,12.22 37.41,9.47 36.7,8.76 35.05,8.76 33.66,10.16 33.66,10.79 JP2.2
USBID  (via drill 0.5 pad 1.27)
  Top 0.305: U$1.11 49.48,22.86 v50.75,24.13
  Bottom 0.305: JP3.ID1 40.98,53.98 44.3,50.67 44.3,38.05 50.75,31.6 v50.75,24.13
VBUS  (via drill 0.5 pad 1.27)
  Top 0.305: U$1.12 48.45,23.51 v49.07,24.13 | IC1.5 39.91,48.36 39.86,48.41 39.86,49.1 39.45,49.51 C5.+
  Top 0.406: v37.13,52.32 38.41,53.59 43.56,53.59 45.72,51.44 45.72,47.62 | 45.72,47.62 45.72,45.09 | 45.72,45.09 45.72,33.02 v49.07,29.67 | 45.71,47.62 45.72,47.62 | U1.3 45.72,45.09
  Top 0.61: C5.+ v37.13,52.32 C27.1
  Bottom 0.305: v49.07,24.13 v49.07,29.67
  Bottom 0.406: JP3.VBUS1 39.03,54.22 v37.13,52.32
VBUSON  (via drill 0.5 pad 1.27)
  Top 0.305: U$1.22 40.04,24.81 v39.34,25.5
  Top 0.406: R15.2 46.95,33.61 v47.62,32.94
  Bottom 0.305: v39.34,25.5 40.03,24.82 47.04,24.82 47.62,25.4 v47.62,32.94